# EAGLE schematic board-scope-R3 (EAGLE 9.0.0)

## Sheet 1 of 5
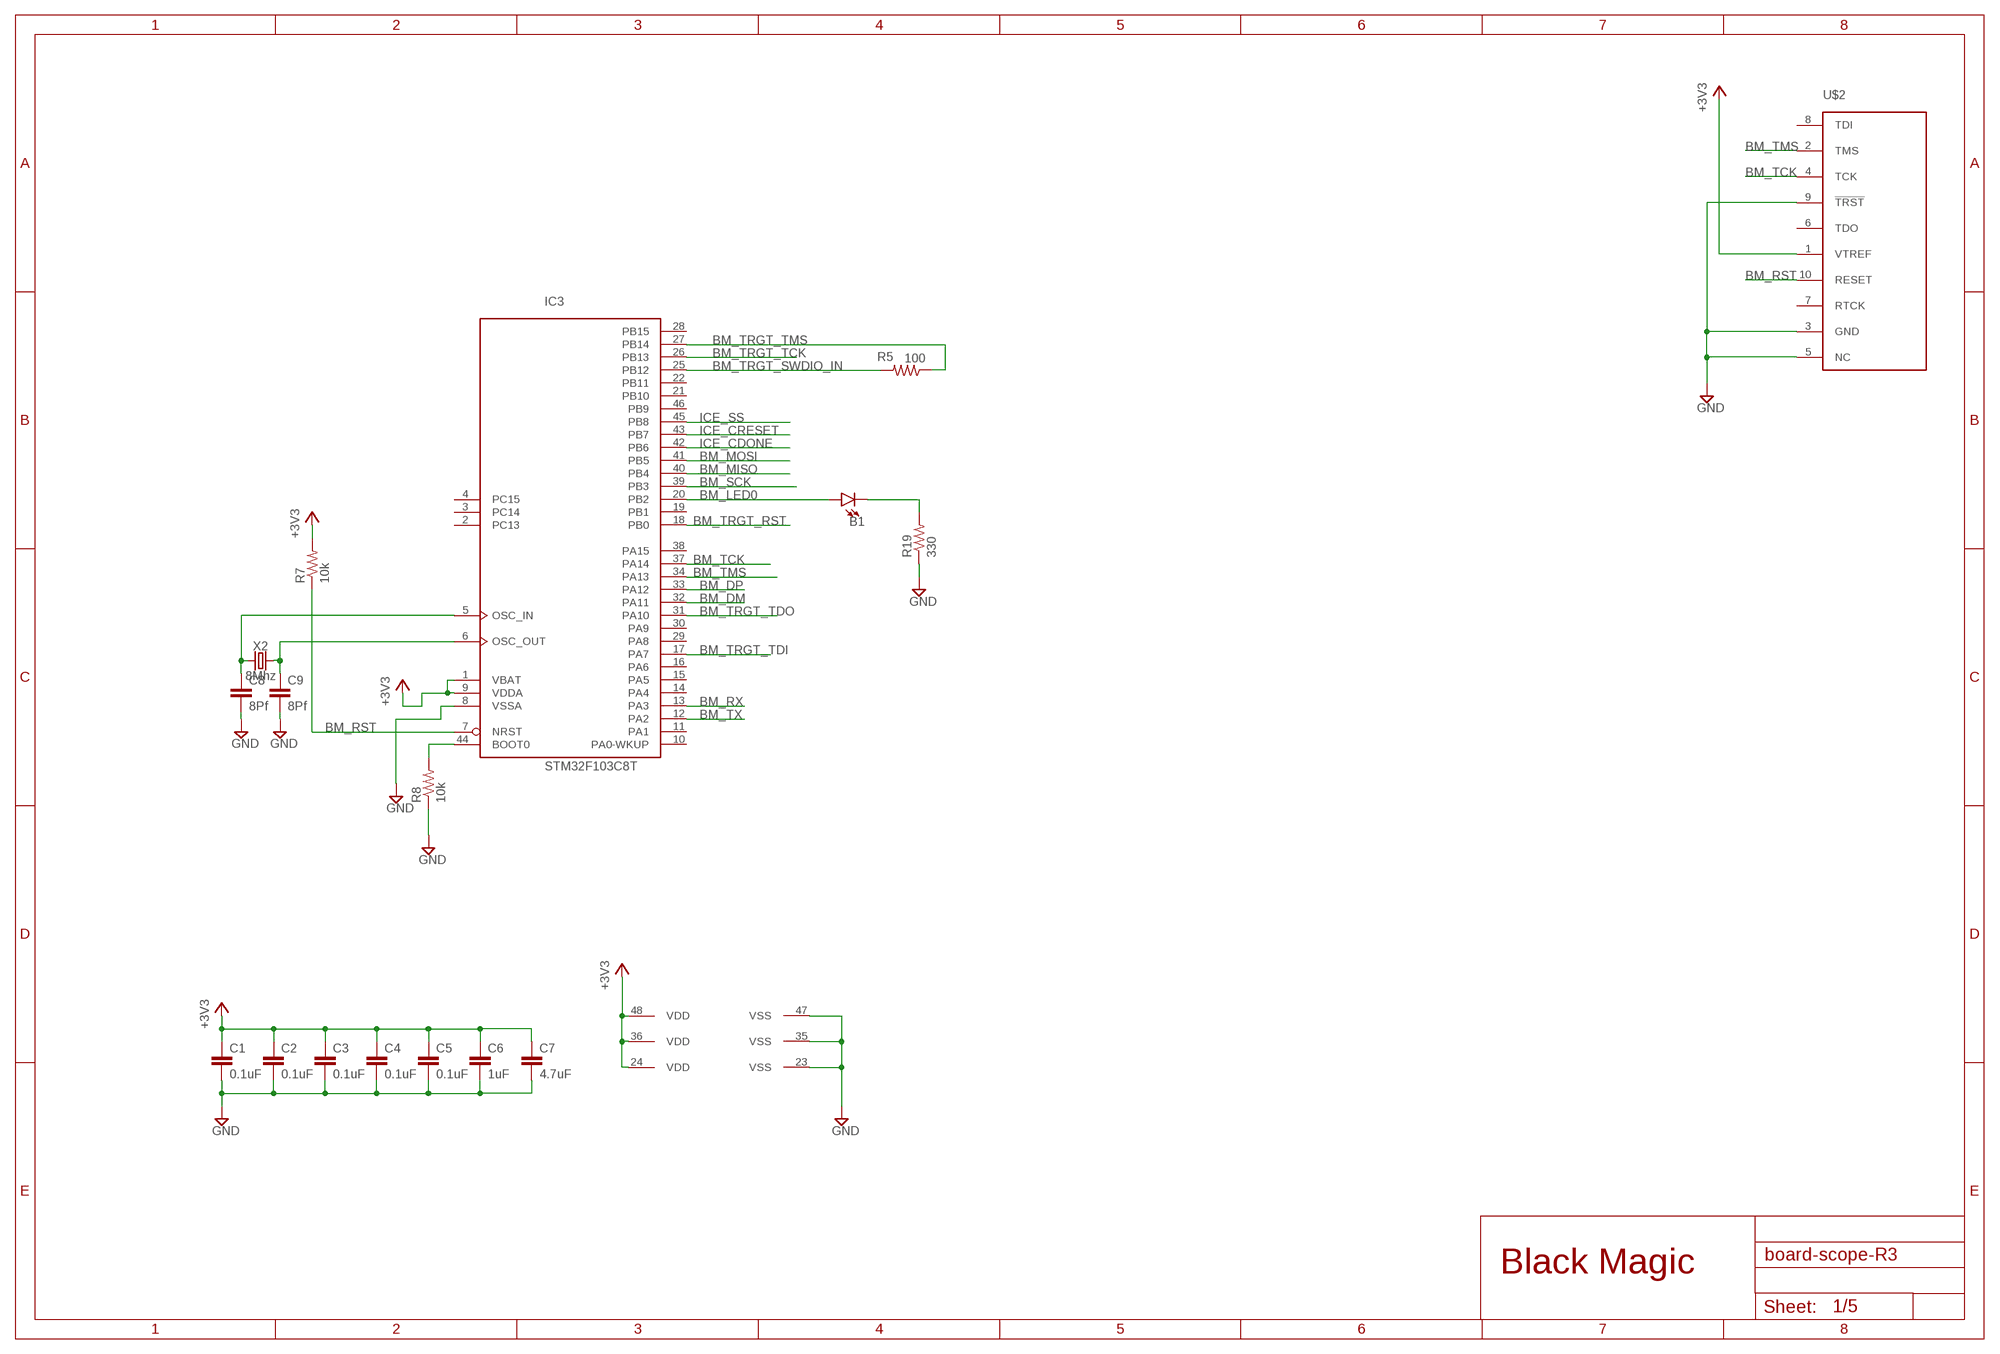
[diagram p0: schematic, sheet 1]

### Parts
B1  LED0603  [LED-0603]
C1  0.1uF  C-EUC0603K  [C0603K]
C2  0.1uF  C-EUC0603K  [C0603K]
C3  0.1uF  C-EUC0603K  [C0603K]
C4  0.1uF  C-EUC0603K  [C0603K]
C5  0.1uF  C-EUC0603K  [C0603K]
C6  1uF  C-EUC0603K  [C0603K]
C7  4.7uF  C-EUC0603K  [C0603K]
C8  8Pf  C-EUC0603K  [C0603K]
C9  8Pf  C-EUC0603K  [C0603K]
IC3  STM32F103C8T  [LQFP48]
R5  100  R-US_R0603  [R0603]
R7  10k  R-US_R0603  [R0603]
R8  10k  R-US_R0603  [R0603]
R19  330  R-US_R0603  [R0603]
U$2  TC2050-NL-MCP-NL  [TC2030-MCP-NL]
X2  8Mhz  CRYSTALSMD-5X3.2-4PAD  [CRYSTAL-SMD-5X3.2-4PAD]

### Nets
+3V3: C1.1 C2.1 C3.1 C4.1 C5.1 C6.1 C7.1 IC3.1(VBAT) IC3.9(VDDA) IC3.24(VDD) IC3.36(VDD) IC3.48(VDD) R7.2 U$2.1(VTREF) ; also sheet 2,3,4,5
BM_DM: IC3.32(PA11) ; also sheet 3
BM_DP: IC3.33(PA12) ; also sheet 3
BM_LED0: B1.A IC3.20(PB2)
BM_MISO: IC3.40(PB4) ; also sheet 2,5
BM_MOSI: IC3.41(PB5) ; also sheet 2,5
BM_RST: IC3.7(NRST) R7.1 U$2.10(RESET) ; also sheet 5
BM_RX: IC3.13(PA3) ; also sheet 2,5
BM_SCK: IC3.39(PB3) ; also sheet 2,5
BM_TCK: IC3.37(PA14) U$2.4(TCK) ; also sheet 5
BM_TMS: IC3.34(PA13) U$2.2(TMS) ; also sheet 5
BM_TRGT_RST: IC3.18(PB0) ; also sheet 2
BM_TRGT_SWDIO_IN: IC3.25(PB12) R5.2
BM_TRGT_TCK: IC3.26(PB13) ; also sheet 2
BM_TRGT_TDI: IC3.17(PA7) ; also sheet 2
BM_TRGT_TDO: IC3.31(PA10) ; also sheet 2
BM_TRGT_TMS: IC3.27(PB14) R5.1 ; also sheet 2
BM_TX: IC3.12(PA2) ; also sheet 2,5
GND: C1.2 C2.2 C3.2 C4.2 C5.2 C6.2 C7.2 C8.2 C9.2 IC3.8(VSSA) IC3.23(VSS) IC3.35(VSS) IC3.47(VSS) R8.1 R19.1 U$2.3(GND) U$2.5(NC) U$2.9(!TRST) ; also sheet 2,3,4,5
ICE_CDONE: IC3.42(PB6) ; also sheet 2,5
ICE_CRESET: IC3.43(PB7) ; also sheet 2,5
ICE_SS: IC3.45(PB8) ; also sheet 2,5
N$3: IC3.44(BOOT0) R8.2
N$7: C8.1 IC3.5(OSC_IN) X2.1
N$16: C9.1 IC3.6(OSC_OUT) X2.3
N$57: B1.C R19.2
Unconnected: IC3.2(PC13) IC3.3(PC14) IC3.4(PC15) IC3.10(PA0-WKUP) IC3.11(PA1) IC3.14(PA4) IC3.15(PA5) IC3.16(PA6) IC3.19(PB1) IC3.21(PB10) IC3.22(PB11) IC3.28(PB15) IC3.29(PA8) IC3.30(PA9) IC3.38(PA15) IC3.46(PB9) U$2.6(TDO) U$2.7(RTCK) U$2.8(TDI)

### Notes on the sheet
- Black Magic

## Sheet 2 of 5
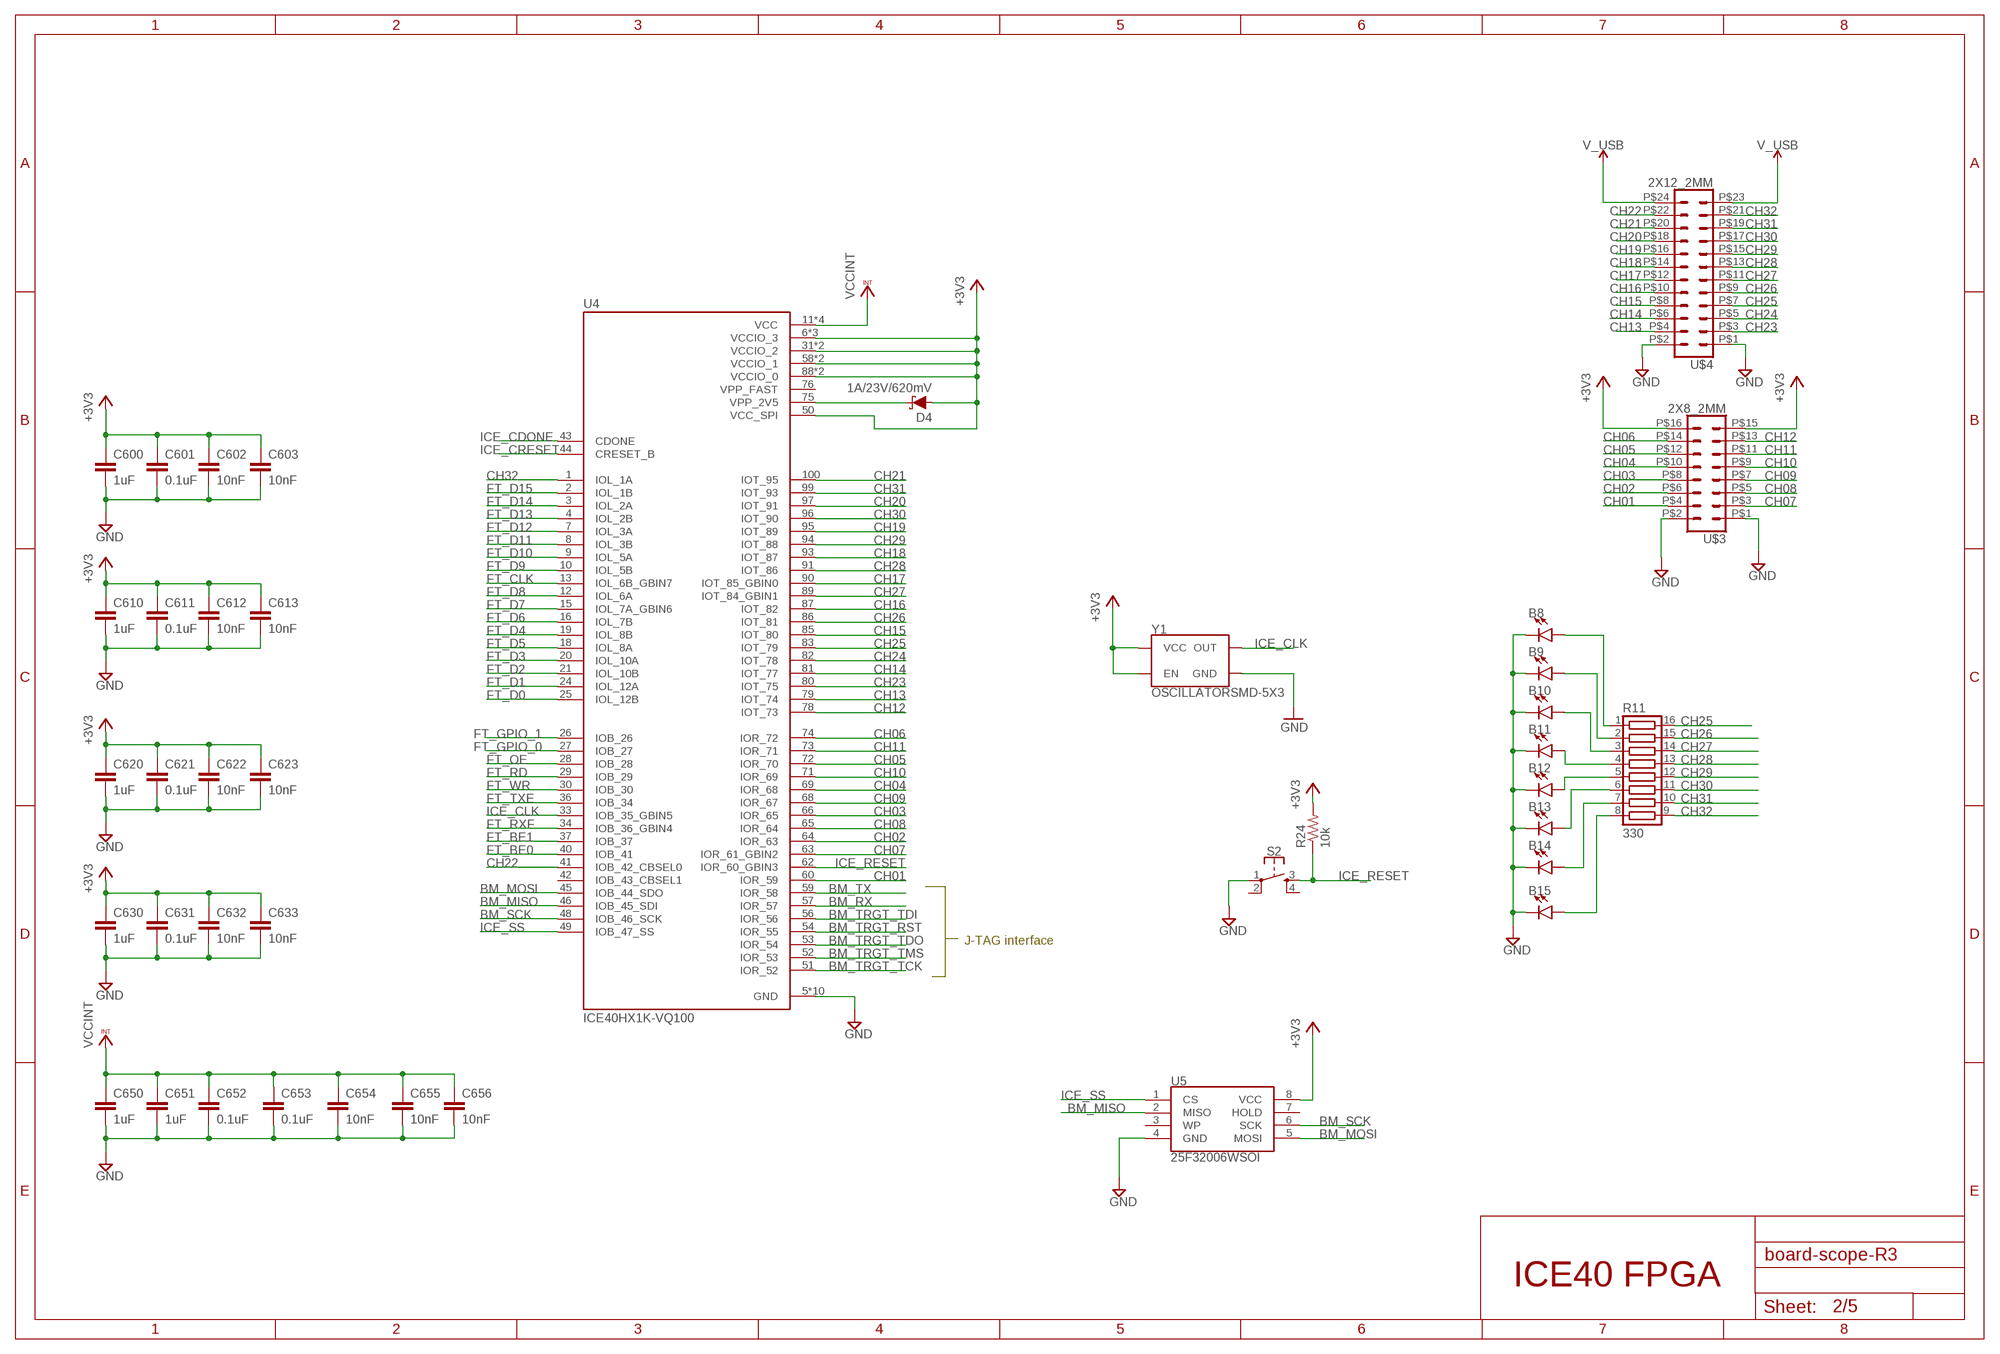
[diagram p1: schematic, sheet 2]

### Parts
B8  LED0603  [LED-0603]
B9  LED0603  [LED-0603]
B10  LED0603  [LED-0603]
B11  LED0603  [LED-0603]
B12  LED0603  [LED-0603]
B13  LED0603  [LED-0603]
B14  LED0603  [LED-0603]
B15  LED0603  [LED-0603]
C600  1uF  C-EUC0603K  [C0603K]
C601  0.1uF  C-EUC0603K  [C0603K]
C602  10nF  C-EUC0603K  [C0603K]
C603  10nF  C-EUC0603K  [C0603K]
C610  1uF  C-EUC0603K  [C0603K]
C611  0.1uF  C-EUC0603K  [C0603K]
C612  10nF  C-EUC0603K  [C0603K]
C613  10nF  C-EUC0603K  [C0603K]
C620  1uF  C-EUC0603K  [C0603K]
C621  0.1uF  C-EUC0603K  [C0603K]
C622  10nF  C-EUC0603K  [C0603K]
C623  10nF  C-EUC0603K  [C0603K]
C630  1uF  C-EUC0603K  [C0603K]
C631  0.1uF  C-EUC0603K  [C0603K]
C632  10nF  C-EUC0603K  [C0603K]
C633  10nF  C-EUC0603K  [C0603K]
C650  1uF  C-EUC0603K  [C0603K]
C651  1uF  C-EUC0603K  [C0603K]
C652  0.1uF  C-EUC0603K  [C0603K]
C653  0.1uF  C-EUC0603K  [C0603K]
C654  10nF  C-EUC0603K  [C0603K]
C655  10nF  C-EUC0603K  [C0603K]
C656  10nF  C-EUC0603K  [C0603K]
D4  1A/23V/620mV  DIODE-SCHOTTKY-BAT20J  [SOD-323]
R11  330  CTS742C163  [CTS743C163]
R24  10k  R-US_R0603  [R0603]
S2  MOMENTARY-SWITCH-SPST-2-SMD-5.2MM  [TACTILE_SWITCH_SMD_5.2MM]
U4  ICE40HX1K-VQ100  [QFP50P1600X1600X120-100N]
U5  25F32006WSOI  SPI_FLASH-X25XXSMD1  [SO08-EIAJ]
U$3  2X8_2MM  [2X8_2MM]
U$4  2X12_2MM  [2X12_2MM]
Y1  OSCILLATORSMD-5X3  [OSCILLATOR-SMD-5X3.2]

### Nets
+3V3: C600.1 C601.1 C602.1 C603.1 C610.1 C611.1 C612.1 C613.1 C620.1 C621.1 C622.1 C623.1 C630.1 C631.1 C632.1 C633.1 D4.A R24.2 U4.6(VCCIO_3) U4.14(VCCIO_3) U4.22(VCCIO_3) U4.31(VCCIO_2) U4.38(VCCIO_2) U4.50(VCC_SPI) U4.58(VCCIO_1) U4.67(VCCIO_1) U4.88(VCCIO_0) U4.92(VCCIO_0) U5.8(VCC) U$3.P$15 U$3.P$16 Y1.1(EN) Y1.4(VCC) ; also sheet 1,3,4,5
BM_MISO: U4.46(IOB_45_SDI) U5.2(MISO) ; also sheet 1,5
BM_MOSI: U4.45(IOB_44_SDO) U5.5(MOSI) ; also sheet 1,5
BM_RX: U4.57(IOR_57) ; also sheet 1,5
BM_SCK: U4.48(IOB_46_SCK) U5.6(SCK) ; also sheet 1,5
BM_TRGT_RST: U4.54(IOR_55) ; also sheet 1
BM_TRGT_TCK: U4.51(IOR_52) ; also sheet 1
BM_TRGT_TDI: U4.56(IOR_56) ; also sheet 1
BM_TRGT_TDO: U4.53(IOR_54) ; also sheet 1
BM_TRGT_TMS: U4.52(IOR_53) ; also sheet 1
BM_TX: U4.59(IOR_58) ; also sheet 1,5
CH01: U4.60(IOR_59) U$3.P$4
CH02: U4.64(IOR_63) U$3.P$6
CH03: U4.66(IOR_65) U$3.P$8
CH04: U4.69(IOR_68) U$3.P$10
CH05: U4.72(IOR_70) U$3.P$12
CH06: U4.74(IOR_72) U$3.P$14
CH07: U4.63(IOR_61_GBIN2) U$3.P$3
CH08: U4.65(IOR_64) U$3.P$5
CH09: U4.68(IOR_67) U$3.P$7
CH10: U4.71(IOR_69) U$3.P$9
CH11: U4.73(IOR_71) U$3.P$11
CH12: U4.78(IOT_73) U$3.P$13
CH13: U4.79(IOT_74) U$4.P$4
CH14: U4.81(IOT_77) U$4.P$6
CH15: U4.85(IOT_80) U$4.P$8
CH16: U4.87(IOT_82) U$4.P$10
CH17: U4.90(IOT_85_GBIN0) U$4.P$12
CH18: U4.93(IOT_87) U$4.P$14
CH19: U4.95(IOT_89) U$4.P$16
CH20: U4.97(IOT_91) U$4.P$18
CH21: U4.100(IOT_95) U$4.P$20
CH22: U4.41(IOB_42_CBSEL0) U$4.P$22
CH23: U4.80(IOT_75) U$4.P$3
CH24: U4.82(IOT_78) U$4.P$5
CH25: R11.16 U4.83(IOT_79) U$4.P$7
CH26: R11.15 U4.86(IOT_81) U$4.P$9
CH27: R11.14 U4.89(IOT_84_GBIN1) U$4.P$11
CH28: R11.13 U4.91(IOT_86) U$4.P$13
CH29: R11.12 U4.94(IOT_88) U$4.P$15
CH30: R11.11 U4.96(IOT_90) U$4.P$17
CH31: R11.10 U4.99(IOT_93) U$4.P$19
CH32: R11.9 U4.1(IOL_1A) U$4.P$21
FT_BE0: U4.40(IOB_41) ; also sheet 4
FT_BE1: U4.37(IOB_37) ; also sheet 4
FT_CLK: U4.13(IOL_6B_GBIN7) ; also sheet 4
FT_D0: U4.25(IOL_12B) ; also sheet 4
FT_D1: U4.24(IOL_12A) ; also sheet 4
FT_D2: U4.21(IOL_10B) ; also sheet 4
FT_D3: U4.20(IOL_10A) ; also sheet 4
FT_D4: U4.19(IOL_8B) ; also sheet 4
FT_D5: U4.18(IOL_8A) ; also sheet 4
FT_D6: U4.16(IOL_7B) ; also sheet 4
FT_D7: U4.15(IOL_7A_GBIN6) ; also sheet 4
FT_D8: U4.12(IOL_6A) ; also sheet 4
FT_D9: U4.10(IOL_5B) ; also sheet 4
FT_D10: U4.9(IOL_5A) ; also sheet 4
FT_D11: U4.8(IOL_3B) ; also sheet 4
FT_D12: U4.7(IOL_3A) ; also sheet 4
FT_D13: U4.4(IOL_2B) ; also sheet 4
FT_D14: U4.3(IOL_2A) ; also sheet 4
FT_D15: U4.2(IOL_1B) ; also sheet 4
FT_GPIO_0: U4.27(IOB_27) ; also sheet 4
FT_GPIO_1: U4.26(IOB_26) ; also sheet 4
FT_OE: U4.28(IOB_28) ; also sheet 4
FT_RD: U4.29(IOB_29) ; also sheet 4
FT_RXF: U4.34(IOB_36_GBIN4) ; also sheet 4
FT_TXE: U4.36(IOB_34) ; also sheet 4
FT_WR: U4.30(IOB_30) ; also sheet 4
GND: B8.C B9.C B10.C B11.C B12.C B13.C B14.C B15.C C600.2 C601.2 C602.2 C603.2 C610.2 C611.2 C612.2 C613.2 C620.2 C621.2 C622.2 C623.2 C630.2 C631.2 C632.2 C633.2 C650.2 C651.2 C652.2 C653.2 C654.2 C655.2 C656.2 S2.1 U4.5(GND) U4.17(GND) U4.23(GND) U4.32(GND) U4.39(GND) U4.47(GND) U4.55(GND) U4.70(GND) U4.84(GND) U4.98(GND) U5.4(GND) U$3.P$1 U$3.P$2 U$4.P$1 U$4.P$2 Y1.2(GND) ; also sheet 1,3,4,5
ICE_CDONE: U4.43(CDONE) ; also sheet 1,5
ICE_CLK: U4.33(IOB_35_GBIN5) Y1.3(OUT)
ICE_CRESET: U4.44(CRESET_B) ; also sheet 1,5
ICE_RESET: R24.1 S2.3 U4.62(IOR_60_GBIN3)
ICE_SS: U4.49(IOB_47_SS) U5.1(CS) ; also sheet 1,5
N$1: D4.C U4.75(VPP_2V5)
N$13: B8.A R11.1
N$14: B9.A R11.2
N$15: B10.A R11.3
N$20: B11.A R11.4
N$21: B12.A R11.5
N$34: B13.A R11.6
N$35: B14.A R11.7
N$36: B15.A R11.8
V_USB: U$4.P$23 U$4.P$24 ; also sheet 3,4,5
VCCINT: C650.1 C651.1 C652.1 C653.1 C654.1 C655.1 C656.1 U4.11(VCC) U4.35(VCC) U4.61(VCC) U4.77(VCC) ; also sheet 3,5
Unconnected: S2.2 S2.4 U4.42(IOB_43_CBSEL1) U5.3(WP) U5.7(HOLD)

### Notes on the sheet
- J-TAG interface
- ICE40 FPGA

## Sheet 3 of 5
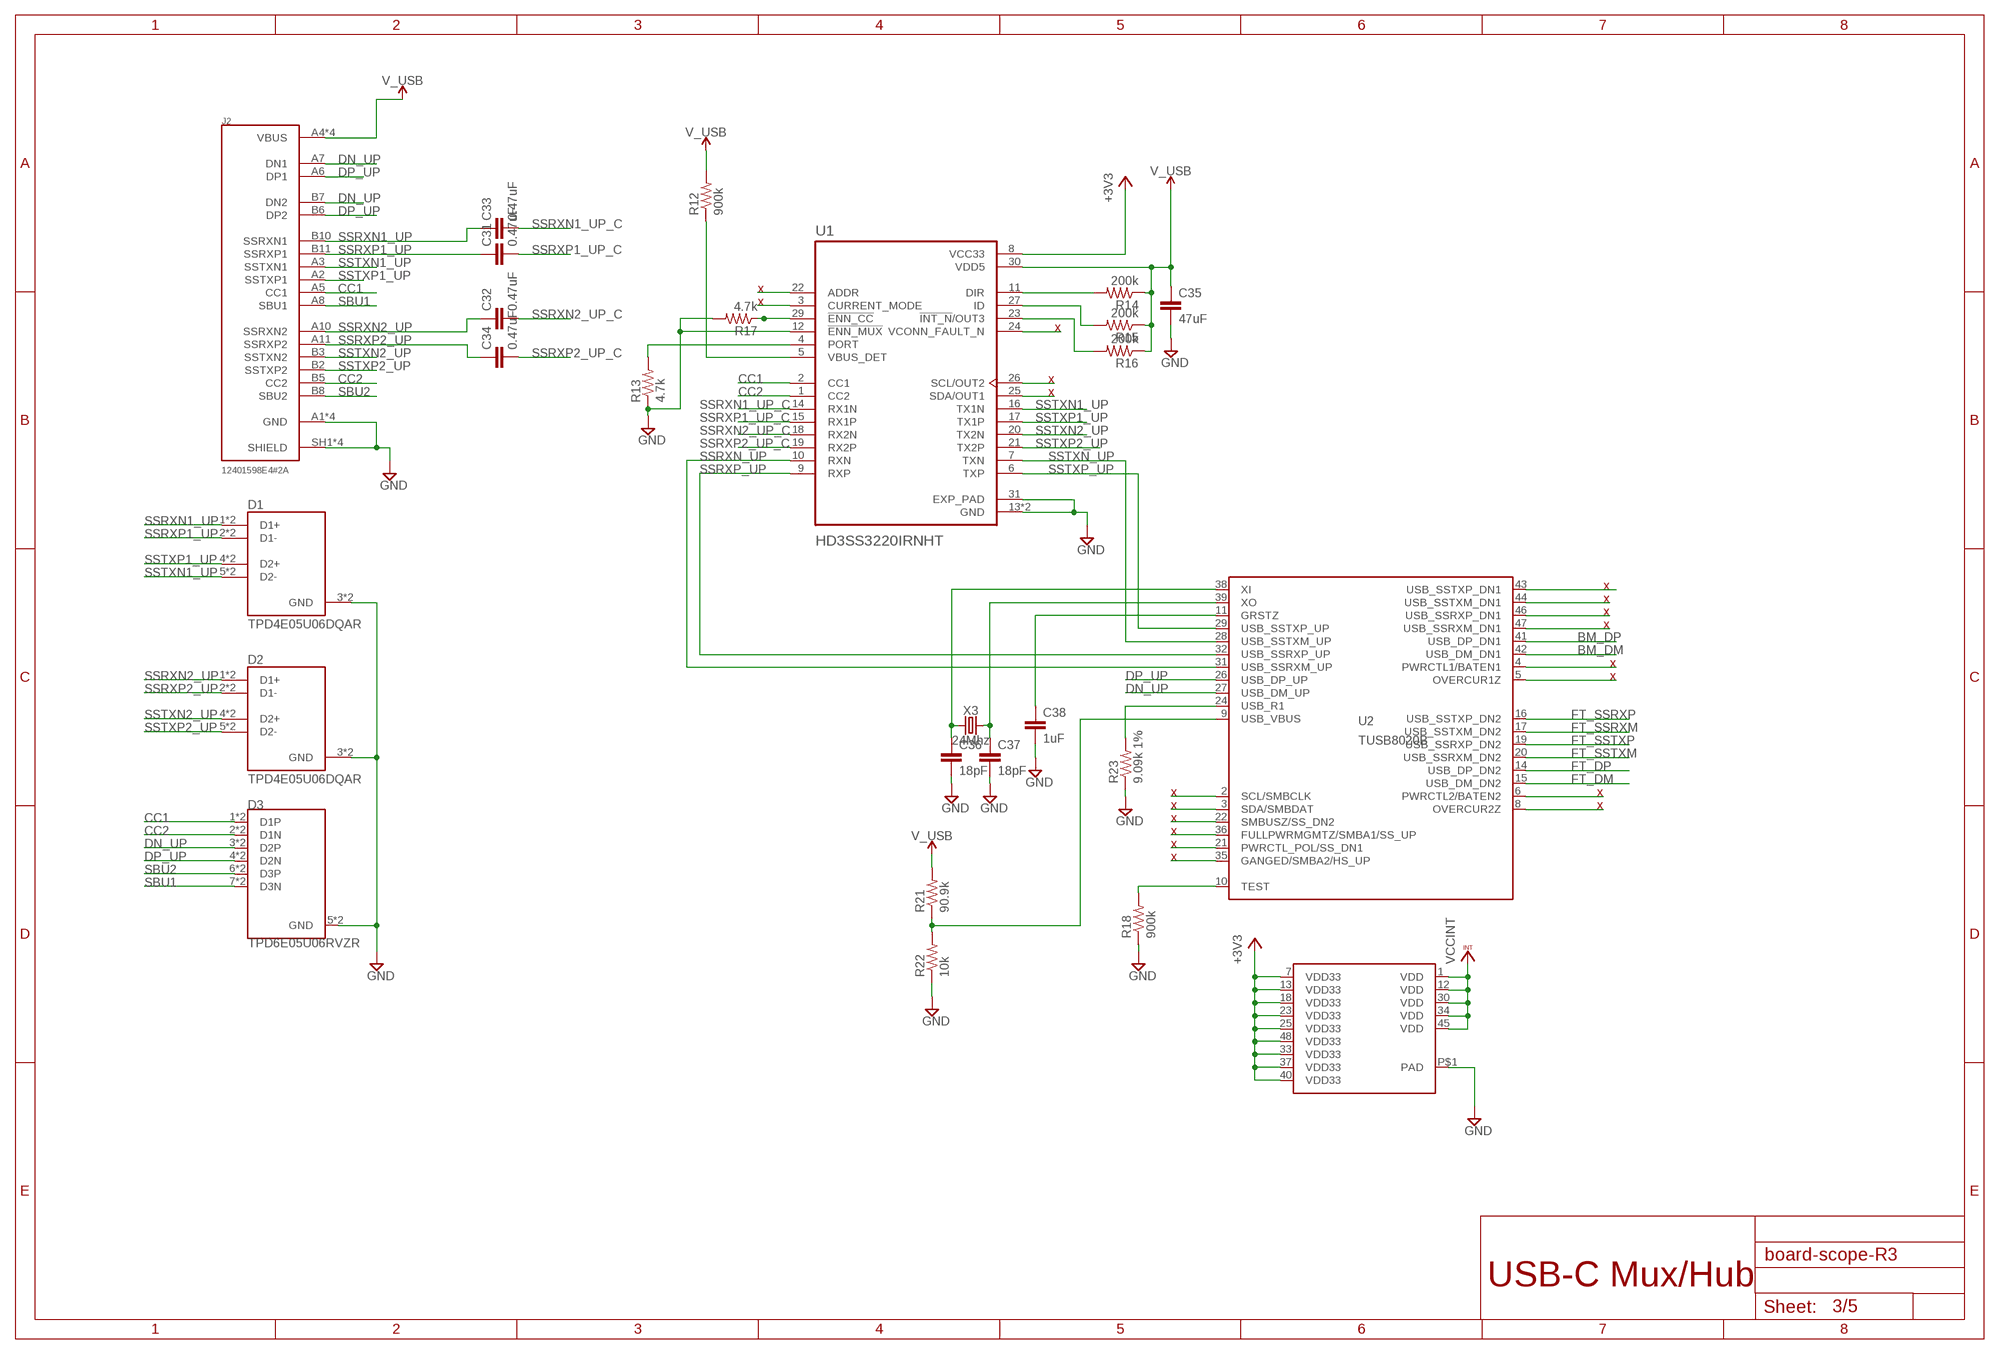
[diagram p2: schematic, sheet 3]

### Parts
C31  0.47uF  C-EUC0603K  [C0603K]
C32  0.47uF  C-EUC0603K  [C0603K]
C33  0.47uF  C-EUC0603K  [C0603K]
C34  0.47uF  C-EUC0603K  [C0603K]
C35  47uF  C-EUC0603K  [C0603K]
C36  18pF  C-EUC0603K  [C0603K]
C37  18pF  C-EUC0603K  [C0603K]
C38  1uF  C-EUC0603K  [C0603K]
D1  TPD4E05U06DQAR  [TI_TPD4E05U06DQAR]
D2  TPD4E05U06DQAR  [TI_TPD4E05U06DQAR]
D3  TPD6E05U06RVZR  [SON50P135X350X55-14N]
J2  12401598E4#2A  [AMPHENOL_12401598E4#2A]
R12  900k  R-US_R0603  [R0603]
R13  4.7k  R-US_R0603  [R0603]
R14  200k  R-US_R0603  [R0603]
R15  200k  R-US_R0603  [R0603]
R16  200k  R-US_R0603  [R0603]
R17  4.7k  R-US_R0603  [R0603]
R18  900k  R-US_R0603  [R0603]
R21  90.9k  R-US_R0603  [R0603]
R22  10k  R-US_R0603  [R0603]
R23  9.09k 1%  R-US_R0603  [R0603]
U1  HD3SS3220IRNHT  [QFN40P450X250X80-31N120X320]
U2  TUSB8020B  [TQFP48]
X3  24Mhz  CRYSTALSMD-5X3.2-4PAD  [CRYSTAL-SMD-5X3.2-4PAD]

### Nets
+3V3: U1.8(VCC33) U2.7(VDD33) U2.13(VDD33) U2.18(VDD33) U2.23(VDD33) U2.25(VDD33) U2.33(VDD33) U2.37(VDD33) U2.40(VDD33) U2.48(VDD33) ; also sheet 1,2,4,5
BM_DM: U2.42(USB_DM_DN1) ; also sheet 1
BM_DP: U2.41(USB_DP_DN1) ; also sheet 1
CC1: D3.1(D1P) D3.14(D1P) J2.A5(CC1) U1.2(CC1)
CC2: D3.2(D1N) D3.13(D1N) J2.B5(CC2) U1.1(CC2)
DN_UP: D3.3(D2P) D3.12(D2P) J2.A7(DN1) J2.B7(DN2) U2.27(USB_DM_UP)
DP_UP: D3.4(D2N) D3.11(D2N) J2.A6(DP1) J2.B6(DP2) U2.26(USB_DP_UP)
FT_DM: U2.15(USB_DM_DN2) ; also sheet 4
FT_DP: U2.14(USB_DP_DN2) ; also sheet 4
FT_SSRXM: U2.17(USB_SSTXM_DN2) ; also sheet 4
FT_SSRXP: U2.16(USB_SSTXP_DN2) ; also sheet 4
FT_SSTXM: U2.20(USB_SSRXM_DN2) ; also sheet 4
FT_SSTXP: U2.19(USB_SSRXP_DN2) ; also sheet 4
GND: C35.2 C36.2 C37.2 C38.2 D1.3(GND) D1.8(GND) D2.3(GND) D2.8(GND) D3.5(GND) D3.10(GND) J2.A1(GND) J2.A12(GND) J2.B1(GND) J2.B12(GND) J2.SH1(SHIELD) J2.SH2(SHIELD) J2.SH3(SHIELD) J2.SH4(SHIELD) R13.1 R17.2 R18.1 R22.1 R23.1 U1.12(!ENN_MUX) U1.13(GND) U1.28(GND) U1.31(EXP_PAD) U2.P$1(PAD) ; also sheet 1,2,4,5
N$4: R12.1 U1.5(VBUS_DET)
N$9: R13.2 U1.4(PORT)
N$10: R15.2 U1.27(ID)
N$11: U1.22(ADDR)
N$12: U1.3(CURRENT_MODE)
N$18: U2.2(SCL/SMBCLK)
N$22: R17.1 U1.29(!ENN_CC)
N$23: R14.2 U1.11(DIR)
N$24: U1.26(SCL/OUT2)
N$37: R16.2 U1.23(!INT_N!/OUT3)
N$38: U1.24(VCONN_FAULT_N)
N$39: U1.25(SDA/OUT1)
N$40: U2.3(SDA/SMBDAT)
N$41: U2.22(SMBUSZ/SS_DN2)
N$42: U2.36(FULLPWRMGMTZ/SMBA1/SS_UP)
N$43: U2.21(PWRCTL_POL/SS_DN1)
N$44: U2.35(GANGED/SMBA2/HS_UP)
N$45: R18.2 U2.10(TEST)
N$46: U2.6(PWRCTL2/BATEN2)
N$47: U2.8(OVERCUR2Z)
N$48: U2.4(PWRCTL1/BATEN1)
N$49: U2.5(OVERCUR1Z)
N$50: U2.47(USB_SSRXM_DN1)
N$51: U2.46(USB_SSRXP_DN1)
N$52: U2.44(USB_SSTXM_DN1)
N$53: U2.43(USB_SSTXP_DN1)
N$54: C36.1 U2.38(XI) X3.1
N$55: C37.1 U2.39(XO) X3.3
N$62: C38.1 U2.11(GRSTZ)
N$63: R21.1 R22.2 U2.9(USB_VBUS)
N$64: R23.2 U2.24(USB_R1)
SBU1: D3.7(D3N) D3.8(D3N) J2.A8(SBU1)
SBU2: D3.6(D3P) D3.9(D3P) J2.B8(SBU2)
SSRXN1_UP: C33.1 D1.1(D1+) D1.10(D1+) J2.B10(SSRXN1)
SSRXN1_UP_C: C33.2 U1.14(RX1N)
SSRXN2_UP: C32.1 D2.1(D1+) D2.10(D1+) J2.A10(SSRXN2)
SSRXN2_UP_C: C32.2 U1.18(RX2N)
SSRXN_UP: U1.10(RXN) U2.31(USB_SSRXM_UP)
SSRXP1_UP: C31.1 D1.2(D1-) D1.9(D1-) J2.B11(SSRXP1)
SSRXP1_UP_C: C31.2 U1.15(RX1P)
SSRXP2_UP: C34.1 D2.2(D1-) D2.9(D1-) J2.A11(SSRXP2)
SSRXP2_UP_C: C34.2 U1.19(RX2P)
SSRXP_UP: U1.9(RXP) U2.32(USB_SSRXP_UP)
SSTXN1_UP: D1.5(D2-) D1.6(D2-) J2.A3(SSTXN1) U1.16(TX1N)
SSTXN2_UP: D2.4(D2+) D2.7(D2+) J2.B3(SSTXN2) U1.20(TX2N)
SSTXN_UP: U1.7(TXN) U2.28(USB_SSTXM_UP)
SSTXP1_UP: D1.4(D2+) D1.7(D2+) J2.A2(SSTXP1) U1.17(TX1P)
SSTXP2_UP: D2.5(D2-) D2.6(D2-) J2.B2(SSTXP2) U1.21(TX2P)
SSTXP_UP: U1.6(TXP) U2.29(USB_SSTXP_UP)
V_USB: C35.1 J2.A4(VBUS) J2.A9(VBUS) J2.B4(VBUS) J2.B9(VBUS) R12.2 R14.1 R15.1 R16.1 R21.2 U1.30(VDD5) ; also sheet 2,4,5
VCCINT: U2.1(VDD) U2.12(VDD) U2.30(VDD) U2.34(VDD) U2.45(VDD) ; also sheet 2,5

### Notes on the sheet
- x
- x
- x
- x
- x
- x
- x
- x
- x
- x
- x
- x | x
- x | x
- x
- x
- x
- x
- USB-C Mux/Hub

## Sheet 4 of 5
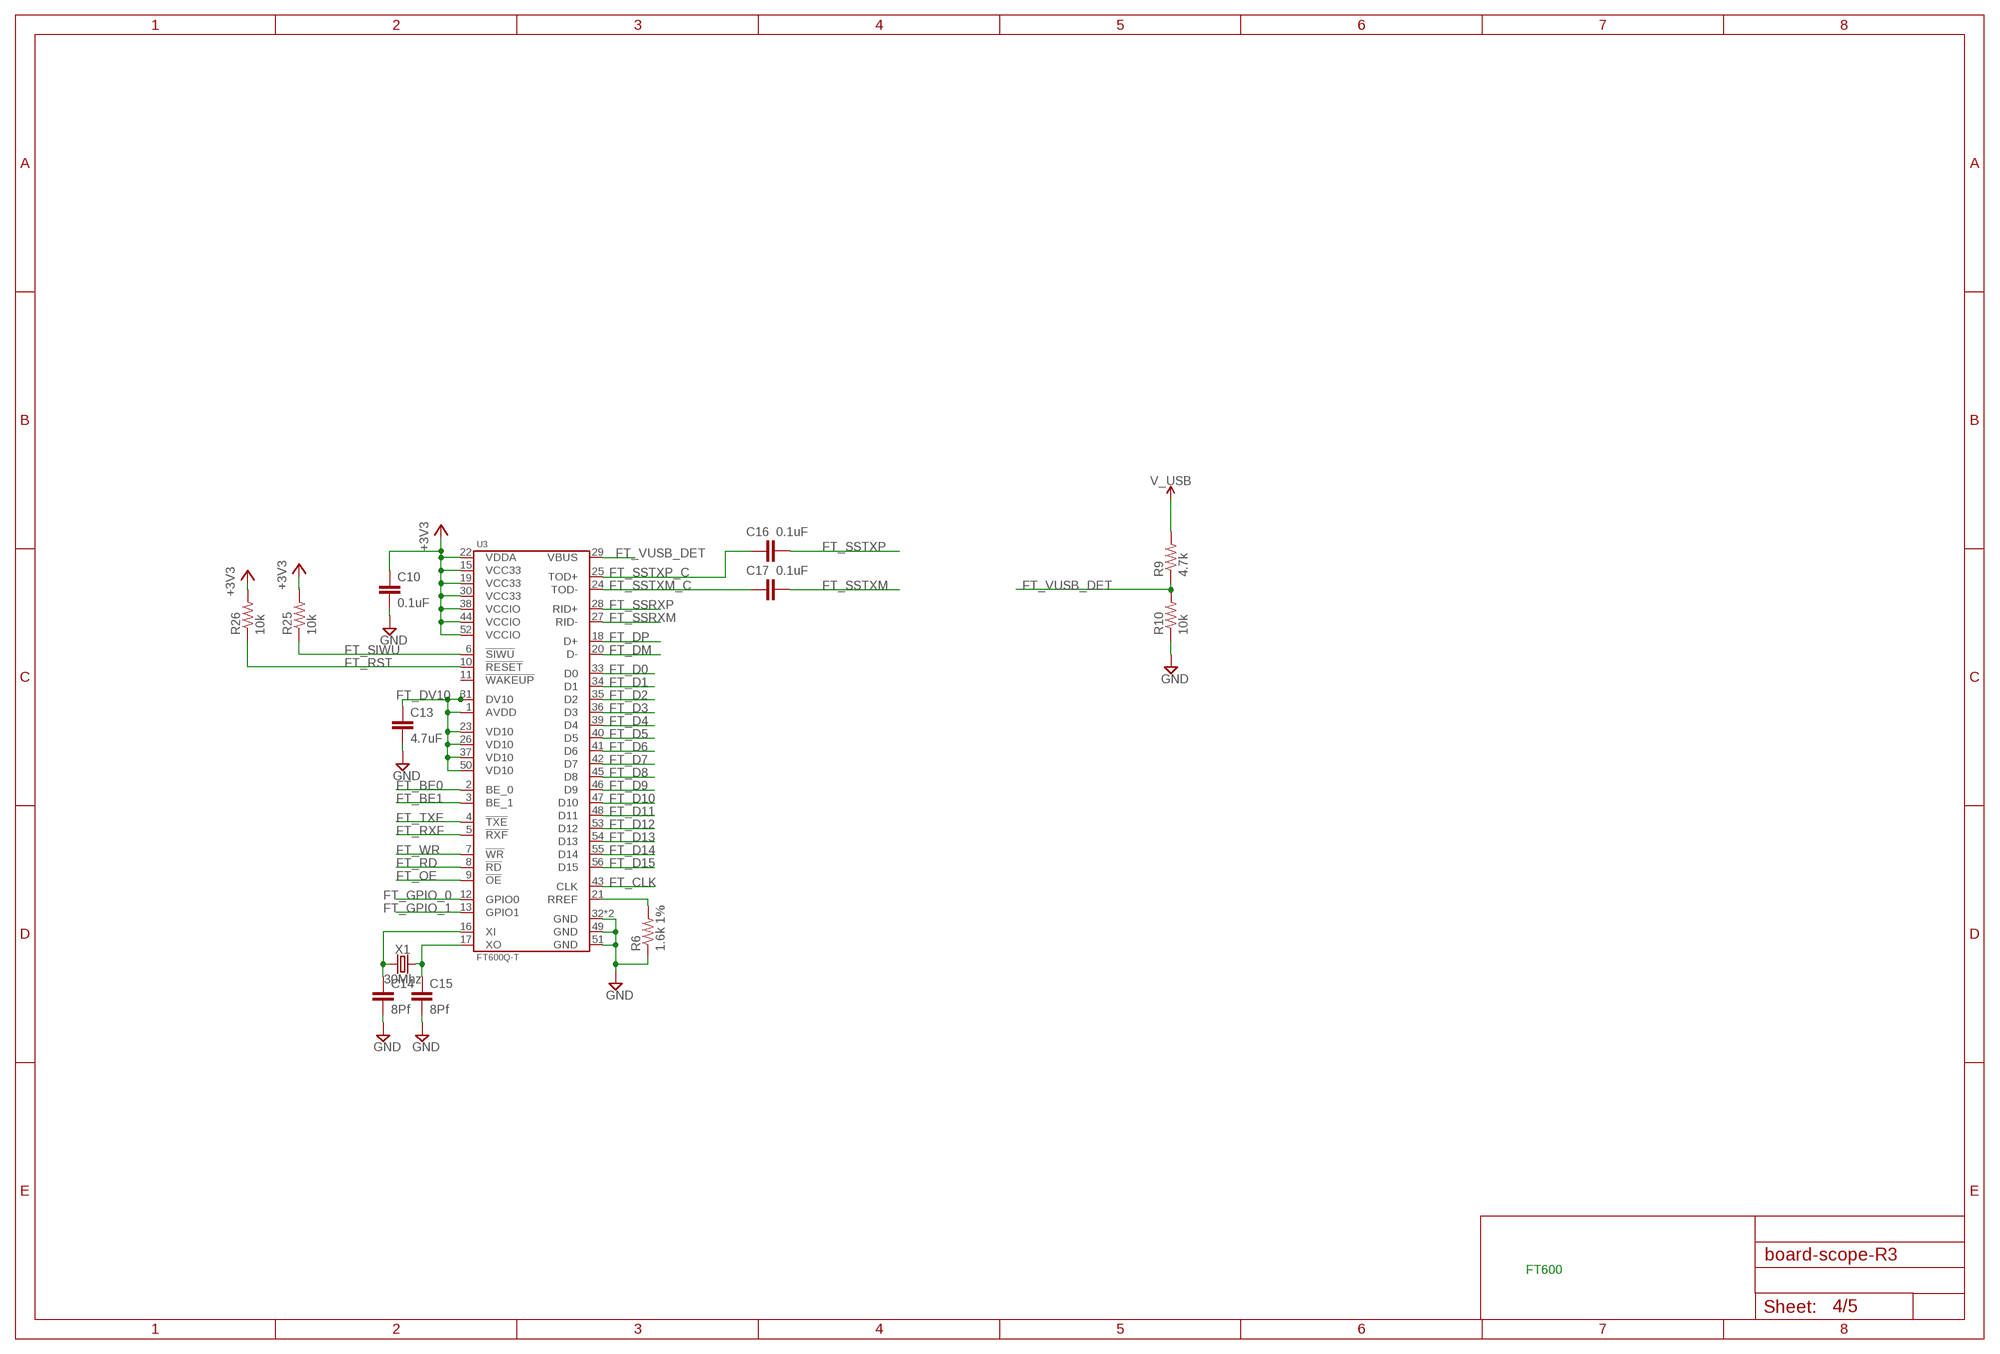
[diagram p3: schematic, sheet 4]

### Parts
C10  0.1uF  C-EUC0603K  [C0603K]
C13  4.7uF  C-EUC0603K  [C0603K]
C14  8Pf  C-EUC0603K  [C0603K]
C15  8Pf  C-EUC0603K  [C0603K]
C16  0.1uF  C-EUC0603K  [C0603K]
C17  0.1uF  C-EUC0603K  [C0603K]
R6  1.6k 1%  R-US_R0603  [R0603]
R9  4.7k  R-US_R0603  [R0603]
R10  10k  R-US_R0603  [R0603]
R25  10k  R-US_R0603  [R0603]
R26  10k  R-US_R0603  [R0603]
U3  FT600Q-T  [VQFN-56-7MM]
X1  30Mhz  CRYSTALSMD-5X3.2-4PAD  [CRYSTAL-SMD-5X3.2-4PAD]

### Nets
+3V3: C10.1 R25.2 R26.2 U3.15(VCC33) U3.19(VCC33) U3.22(VDDA) U3.30(VCC33) U3.38(VCCIO) U3.44(VCCIO) U3.52(VCCIO) ; also sheet 1,2,3,5
FT_BE0: U3.2(BE_0) ; also sheet 2
FT_BE1: U3.3(BE_1) ; also sheet 2
FT_CLK: U3.43(CLK) ; also sheet 2
FT_D0: U3.33(D0) ; also sheet 2
FT_D1: U3.34(D1) ; also sheet 2
FT_D2: U3.35(D2) ; also sheet 2
FT_D3: U3.36(D3) ; also sheet 2
FT_D4: U3.39(D4) ; also sheet 2
FT_D5: U3.40(D5) ; also sheet 2
FT_D6: U3.41(D6) ; also sheet 2
FT_D7: U3.42(D7) ; also sheet 2
FT_D8: U3.45(D8) ; also sheet 2
FT_D9: U3.46(D9) ; also sheet 2
FT_D10: U3.47(D10) ; also sheet 2
FT_D11: U3.48(D11) ; also sheet 2
FT_D12: U3.53(D12) ; also sheet 2
FT_D13: U3.54(D13) ; also sheet 2
FT_D14: U3.55(D14) ; also sheet 2
FT_D15: U3.56(D15) ; also sheet 2
FT_DM: U3.20(D-) ; also sheet 3
FT_DP: U3.18(D+) ; also sheet 3
FT_DV10: C13.1 U3.1(AVDD) U3.23(VD10) U3.26(VD10) U3.31(DV10) U3.37(VD10) U3.50(VD10)
FT_GPIO_0: U3.12(GPIO0) ; also sheet 2
FT_GPIO_1: U3.13(GPIO1) ; also sheet 2
FT_OE: U3.9(!OE) ; also sheet 2
FT_RD: U3.8(!RD) ; also sheet 2
FT_RST: R26.1 U3.10(!RESET)
FT_RXF: U3.5(!RXF) ; also sheet 2
FT_SIWU: R25.1 U3.6(!SIWU)
FT_SSRXM: U3.27(RID-) ; also sheet 3
FT_SSRXP: U3.28(RID+) ; also sheet 3
FT_SSTXM: C17.2 ; also sheet 3
FT_SSTXM_C: C17.1 U3.24(TOD-)
FT_SSTXP: C16.2 ; also sheet 3
FT_SSTXP_C: C16.1 U3.25(TOD+)
FT_TXE: U3.4(!TXE) ; also sheet 2
FT_VUSB_DET: R9.1 R10.2 U3.29(VBUS)
FT_WR: U3.7(!WR) ; also sheet 2
GND: C10.2 C13.2 C14.2 C15.2 R6.1 R10.1 U3.32(GND) U3.49(GND) U3.51(GND) U3.PAD(GND) ; also sheet 1,2,3,5
N$5: R6.2 U3.21(RREF)
N$17: C14.1 U3.16(XI) X1.1
N$19: C15.1 U3.17(XO) X1.3
V_USB: R9.2 ; also sheet 2,3,5
Unconnected: U3.11(!WAKEUP)

### Notes on the sheet
- FT600

## Sheet 5 of 5
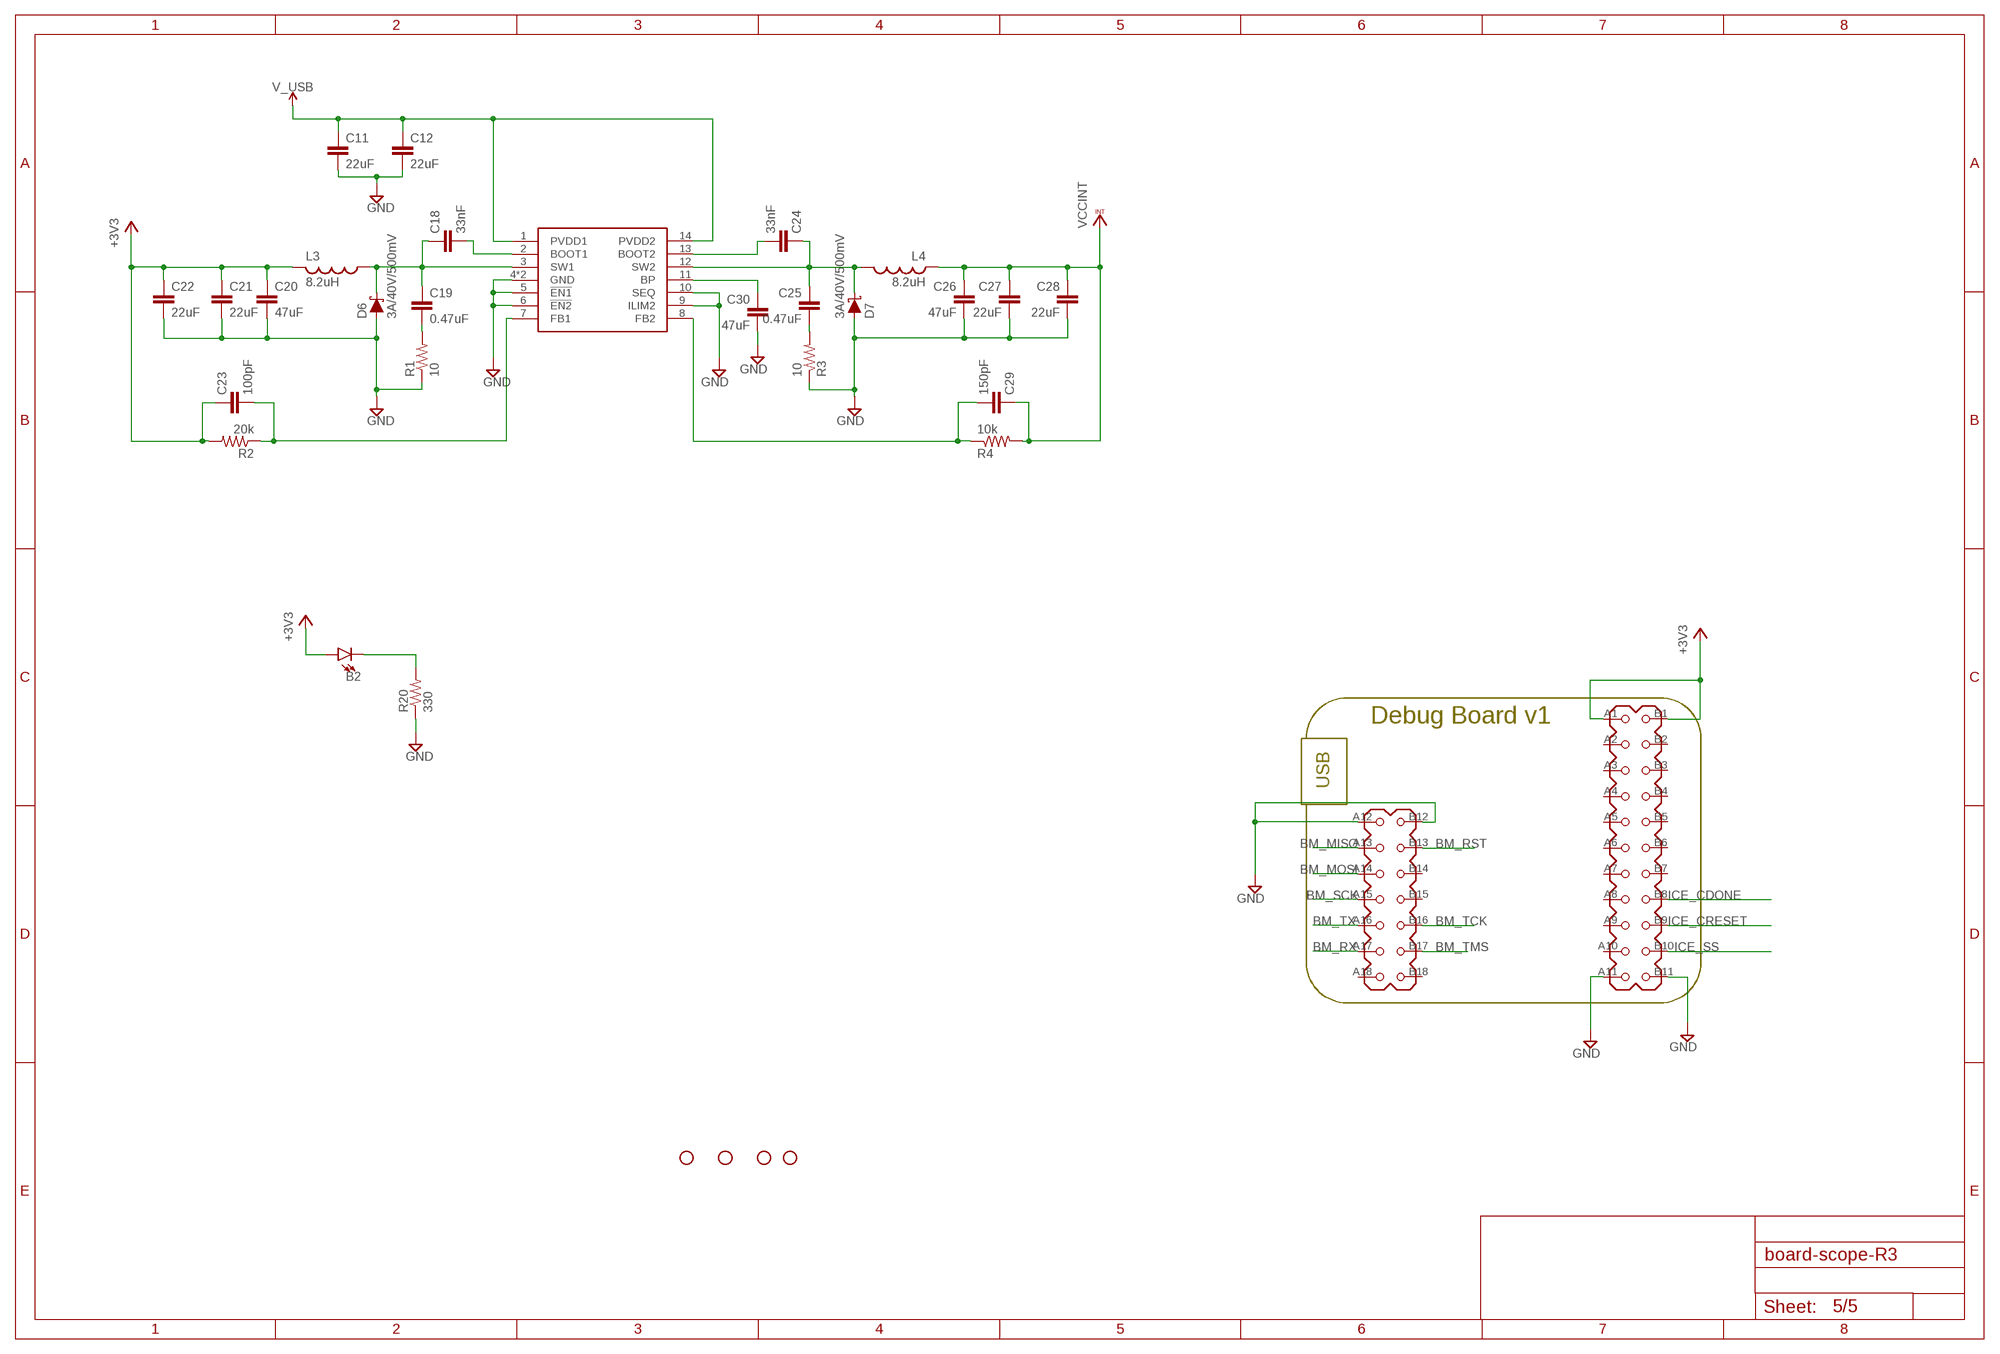
[diagram p4: schematic, sheet 5]

### Parts
B2  LED0603  [LED-0603]
C11  22uF  C-EUC0603K  [C0603K]
C12  22uF  C-EUC0603K  [C0603K]
C18  33nF  C-EUC0603K  [C0603K]
C19  0.47uF  C-EUC0603K  [C0603K]
C20  47uF  C-EUC0603K  [C0603K]
C21  22uF  C-EUC0603K  [C0603K]
C22  22uF  C-EUC0603K  [C0603K]
C23  100pF  C-EUC0603K  [C0603K]
C24  33nF  C-EUC0603K  [C0603K]
C25  0.47uF  C-EUC0603K  [C0603K]
C26  47uF  C-EUC0603K  [C0603K]
C27  22uF  C-EUC0603K  [C0603K]
C28  22uF  C-EUC0603K  [C0603K]
C29  150pF  C-EUC0603K  [C0603K]
C30  47uF  C-EUC0603K  [C0603K]
D6  3A/40V/500mV  DIODE-SCHOTTKY-B340A  [SMA-DIODE]
D7  3A/40V/500mV  DIODE-SCHOTTKY-B340A  [SMA-DIODE]
H1  STAND-OFF  [STAND-OFF]
H2  STAND-OFF  [STAND-OFF]
H3  STAND-OFF  [STAND-OFF]
H4  STAND-OFF  [STAND-OFF]
L3  8.2uH  L-USL5650M  [L5650M]
L4  8.2uH  L-USL5650M  [L5650M]
R1  10  R-US_R0603  [R0603]
R2  20k  R-US_R0603  [R0603]
R3  10  R-US_R0603  [R0603]
R4  10k  R-US_R0603  [R0603]
R20  330  R-US_R0603  [R0603]
U7  TPS54386  [HTSSOP14PWP]
U$1  EDGE_DEBUG  [PCI-E_36_EDGE_MID]

### Nets
+3V3: B2.A C20.1 C21.1 C22.1 C23.1 L3.2 R2.2 U$1.A1 U$1.B1 ; also sheet 1,2,3,4
BM_MISO: U$1.A13 ; also sheet 1,2
BM_MOSI: U$1.A14 ; also sheet 1,2
BM_RST: U$1.B13 ; also sheet 1
BM_RX: U$1.A17 ; also sheet 1,2
BM_SCK: U$1.A15 ; also sheet 1,2
BM_TCK: U$1.B16 ; also sheet 1
BM_TMS: U$1.B17 ; also sheet 1
BM_TX: U$1.A16 ; also sheet 1,2
GND: C11.2 C12.2 C20.2 C21.2 C22.2 C26.2 C27.2 C28.2 C30.2 D6.A D7.A R1.1 R3.1 R20.1 U7.4(GND) U7.5(!EN1!) U7.6(!EN2!) U7.9(ILIM2) U7.10(SEQ) U7.EXP(GND) U$1.A11 U$1.A12 U$1.B11 U$1.B12 ; also sheet 1,2,3,4
ICE_CDONE: U$1.B8 ; also sheet 1,2
ICE_CRESET: U$1.B9 ; also sheet 1,2
ICE_SS: U$1.B10 ; also sheet 1,2
N$25: C18.2 U7.2(BOOT1)
N$26: C18.1 C19.1 D6.C L3.1 U7.3(SW1)
N$27: C19.2 R1.2
N$28: C23.2 R2.1 U7.7(FB1)
N$29: C24.2 U7.13(BOOT2)
N$30: C24.1 C25.1 D7.C L4.1 U7.12(SW2)
N$31: C25.2 R3.2
N$32: C29.2 R4.1 U7.8(FB2)
N$33: C30.1 U7.11(BP)
N$61: B2.C R20.2
V_USB: C11.1 C12.1 U7.1(PVDD1) U7.14(PVDD2) ; also sheet 2,3,4
VCCINT: C26.1 C27.1 C28.1 C29.1 L4.2 R4.2 ; also sheet 2,3
Unconnected: U$1.A2 U$1.A3 U$1.A4 U$1.A5 U$1.A6 U$1.A7 U$1.A8 U$1.A9 U$1.A10 U$1.A18 U$1.B2 U$1.B3 U$1.B4 U$1.B5 U$1.B6 U$1.B7 U$1.B14 U$1.B15 U$1.B18

## Power pins joined to a net without a drawn wire
VPP_FAST: U4.76(VPP_FAST)

## Library data of the parts
B1 B2 B8-B15 = SparkFun-LED:LED: LED (Generic) Standard schematic elements and footprints for 5mm, 3mm, 1206, and 0603 sized LEDs. Generic LEDs with no color specified.
C1-C38 C600-C603 C610-C613 C620-C623 C630-C633 C650-C656 = rcl:C-EU: CAPACITOR, European symbol; SPICEPREFIX: C
D1 D2 = SnapEDA-Library:TPD4E05U06DQAR: 4 Channel Ultra Low Capacitance IEC ESD Protection Diodes 10-USON -40 to 125; MANUFACTURER: Texas Instruments; STANDARD: Manufacturer Recommendation
D3 = SnapEDA-Library:TPD6E05U06RVZR: 6-Channel Ultra low capacitance IEC ESD protection diodes 14-USON -40 to 125; MANUFACTURER: Texas Instruments; PARTREV: L; STANDARD: IPC-7351B
D4 = SparkFun-DiscreteSemi:DIODE-SCHOTTKY: Schottky diode A Schottky diode is a semiconductor diode which has a low forward voltage drop and a very fast switching action.; PROD_ID: DIO-11623
D6 D7 = SparkFun-DiscreteSemi:DIODE-SCHOTTKY: Schottky diode A Schottky diode is a semiconductor diode which has a low forward voltage drop and a very fast switching action.; PROD_ID: DIO-09886
H1-H4 = SparkFun-Hardware:STAND-OFF: Stand Off Drill holes for mechanically mounting via screws, standoffs, etc. Note: Use the keepout ring to avoid running the screw head into surrounding components. Variant Overviews STAND-OFF - Mechanical footprint for a #4 phillips button head screw. STAND-OFF-TIGHT - Mechanical footprint for a #4 phillips button head screw, Example SparkFun Products Screw - Phillips Head (1/4", 4-40, 10 pack) <https://www.sparkfun.com/products/10453> (PRT-10453) Screw - Phillips Head (1/2", 4-40, 10 pack) <https://www.sparkfun.com/products/10452> (PRT-10452) Screw - Phillips Head (3/4", 4-40, 10 pack) <https://www.sparkfun.com/products/10451> (PRT-10451) Screw - Phillips Head (1", 4-40, 10 pack) <https://www.sparkfun.com/products/10450> (PRT-10450)
IC3 = micro-stm:STM32F103C*T: ARM 32-bit Cortex™-M3 CPU 72 MHz maximum frequency 16 to 128 Kbytes of Flash memory 6 to 20 kbytes of SRAM 37 GPIOs 2.0 to 3.6 V application supply
J2 = 12401598E4_2A:12401598E4#2A: Usb Jack 3.1, C Type, 24 Pin, Ho; AVAILABILITY: Unavailable; DESCRIPTION: USB-C _USB TYPE-C_ USB 3.1 _USB 3.1 Gen 2, Superspeed+_ Receptacle Connector 24 Position Surface Mount, Right Angle; Through Hole; MF: Amphenol ICC; MP: 12401598E4#2A; PACKAGE: None; PRICE: None
L3 L4 = rcl:L-US: INDUCTOR, American symbol; SPICEPREFIX: L
R1-R10 R12-R26 = rcl:R-US_: RESISTOR, American symbol; SPICEPREFIX: R
R11 = mylib:CTS742C163
S2 = mylib:MOMENTARY-SWITCH-SPST-2: Momentary Switch (Pushbutton) - SPST - Two Circuits Normally-open (NO) SPST momentary switches (buttons, pushbuttons). Schematic symbol includes two switch circuits. Variants SMD-4.6MMX2.8MM - 4.60mm x 2.80mm Tactile Momentary Button Switch - Used on SparkFun SAMD21 Mini Breakout <https://www.sparkfun.com/products/13664> SMD-5.2MM - Mini Pushbutton Switch - SMD <https://www.sparkfun.com/products/8720> - Used on Arduino Pro Mini <https://www.sparkfun.com/products/11114>; PROD_ID: SWCH-08247; SF_SKU: COM-08720
U1 = HD3SS3220IRNHT:HD3SS3220IRNHT: Super Speed Type-C DRP Port Controller USB 3.1 3.3V/5V T/R 30-Pin WQFN EP; AVAILABILITY: Unavailable; DESCRIPTION: USB, Type-C Controller PMIC 30-WQFN _4.5x2.5_; MF: Texas Instruments; MP: HD3SS3220IRNHT; PACKAGE: WQFN-30 Texas Instruments; PRICE: None
U2 = mylib:TUSB8020B: edit this description Auto generated by make-symbol-device-package-bsdl.ulp Rev. 44 Source:
U3 = mylib:FT600
U4 = mylib:ICE40HX1K-VQ100: HX Series 1280 LUTs 95 I/O 64 kBit RAM 1.2 V Surface Mount FPGA - VQFP-100; AVAILABILITY: Unavailable; DESCRIPTION: IC FPGA 72 I/O 100TQFP; MF: Lattice Semiconductor; MP: ICE40HX1K-VQ100; PACKAGE: TQFP-100 Lattice Semiconductor; PRICE: None
U5 = SparkFun-IC-Memory:SPI_FLASH-X25XX: 32M Serial Flash Memory 8pin SPI Flash series x25xx. Works with devices like W25X32 and BR25L32 Datasheet <http://www.macronix.com/Lists/Datasheet/Attachments/5031/MX25L3206E,%203V,%2032Mb,%20v1.5.pdf> SparkFun Products SparkFun Venus GPS Logger <https://www.sparkfun.com/products/10920> (GPS-10920); PROD_ID: IC-09109
U7 = mylib:TPS54386
U$1 = mylib:EDGE_DEBUG
U$2 = TC2050:TC2050-NL: TAG-CONNECT ISP Connector Manufacturer: Tag-Connect <www.tag-connect.com> Cable for easy In-Circuit PCB Programming. Designed for JTAG 10 pin, suitable for many others. Pin Connection for TC2050 NL. PAD Description 1 VTREF 2 TMS 3 GND 4 TCK 5 NC 6 TDO 7 RTCK 8 TDI 9 !TRST 10 RESET ©2009 ROFA.cz Modified 7/2011 by Tim McCarthy-Smith VIDA Products INC
U$3 = mylib:2X8_2MM
U$4 = mylib:2X12_2MM
X1-X3 = SparkFun-Clocks:CRYSTAL: Crystals (Generic) These are passive quartz crystals, which can be used as a clock source for a microcontroller. Crystal's are two-terminal devices. They require external "load" capacitors to generate an oscillating signal.
Y1 = SparkFun-Clocks:OSCILLATOR: Oscillators (Generic) These are active oscillators, which require a power source to generate their clock output. Most oscillators are configured to generate a set frequency (e.g. 16MHz). They have four pins: power, ground, output, and an enable input.

## Net classes
0 default: width 0.152 mm, clearance 0.205 mm